# Altium schematic sheet flexPCB.SchDoc
size A; SheetNumber: 2; SheetTotal: 1
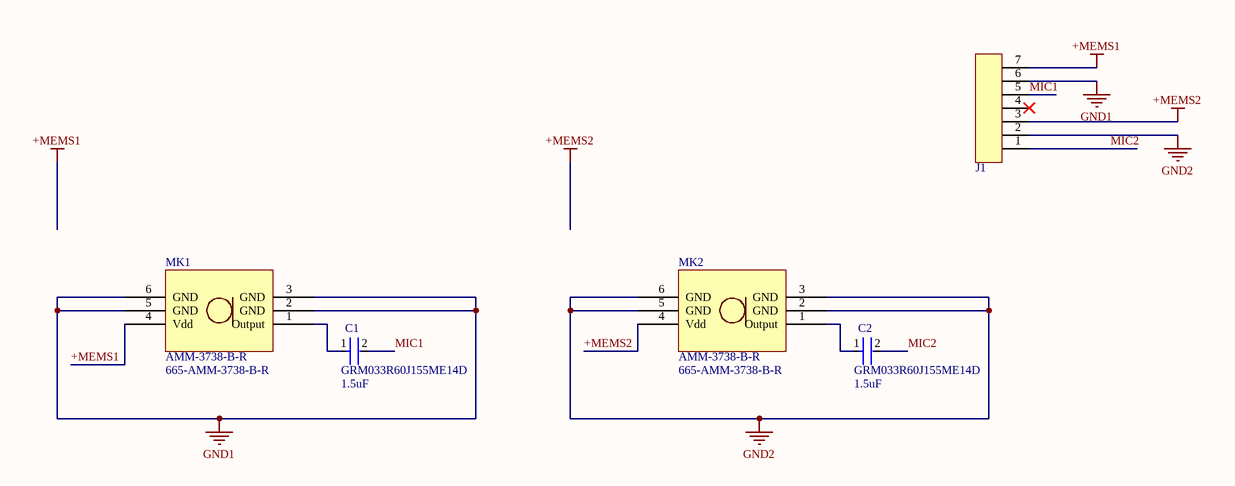
[diagram p0: flexPCB.SchDoc]

## Parts
C1  GRM033R60J155ME14D  [FP-GRM033-0_03-IPC_B]
C2  GRM033R60J155ME14D  [FP-GRM033-0_03-IPC_B]
J1  FFC EDGE BOTTOM  [HIROSE_FH58M-7S-0.25SHW-99_BOTTOMFFC]  (value not drawn)
MK1  AMM-3738-B-R  [665-AMM-3738-B-R]
MK2  AMM-3738-B-R  [665-AMM-3738-B-R]

## Nets
+MEMS1: J1.7 MK1.4(Vdd)
+MEMS2: J1.3 MK2.4(Vdd)
GND1: J1.6 MK1.2(GND) MK1.3(GND) MK1.5(GND) MK1.6(GND)
GND2: J1.2 MK2.2(GND) MK2.3(GND) MK2.5(GND) MK2.6(GND)
MIC1: C1.2 J1.5
MIC2: C2.2 J1.1
NetC1_1: C1.1 MK1.1(Output)
NetC2_1: C2.1 MK2.1(Output)

Not connected (* = marked no-connect by the designer): J1 4*

## Notes on the sheet
- (near C1) 1.5uF
- (near C2) 1.5uF

## Library data of the parts
C1 C2 = CMP-06035-017352-1: Chip Multilayer Ceramic Capacitors for General Purpose, 0201, 1.5uF, X5R, 15%, 20%, 6.3V; Case/Package: 0201; Packaging: Tape and Reel; Case Code (Imperial): 0201; Capacitance: 1.5uF; Max Operating Temperature: 85°C; Voltage Rating (DC): 6.3V; Dielectric: X5R; Min Operating Temperature: -55°C; Voltage Rating: 6.3V; Tolerance: 20%; Mount: Surface Mount; Case Code (Metric): 0603; Thickness: 0.013inch; Length: 0.024inch; Width: 0.012inch
J1 = HIROSE_FH58M-7S-0.25SHW-99_BOTTOM: Bottom FFC Land Pattern for Hirose FH58M-7S-0.25SHW(99) 7-pin Top+Bottom Contact FFC Connector
MK1 MK2 = AMM-3738-B-R: Manufacturer: PUI Audio; Supplier 1: Mouser; Supplier Part Number 1: 665-AMM-3738-B-R